# Altium schematic sheet Fabric_E_CON.SchDoc: Metlino
size 420 x 297 mm; CheckedBy: P.Kulik,T.Przywozki,W.Ruclo; Author: G.Kasprowicz; CompanyName: WUT ISE; DrawnBy: G.Kasprowicz; Organization: WUT ISE; Address1: PW ISE; Address2: Nowowiejska 15/19 00-665 Warsaw; Address3: gkasprow@gmail.com; DocumentNumber: 15; Revision: 2; SheetNumber: 15; SheetTotal: 29; ModifiedBy: -; CheckedDate: -; Title2: MCH Tongue 3&4 connectors; DivGrp: WUT ISE; Designer: G.Kasprowicz; ModifiedDate: -; ProjectName: Sensor Box
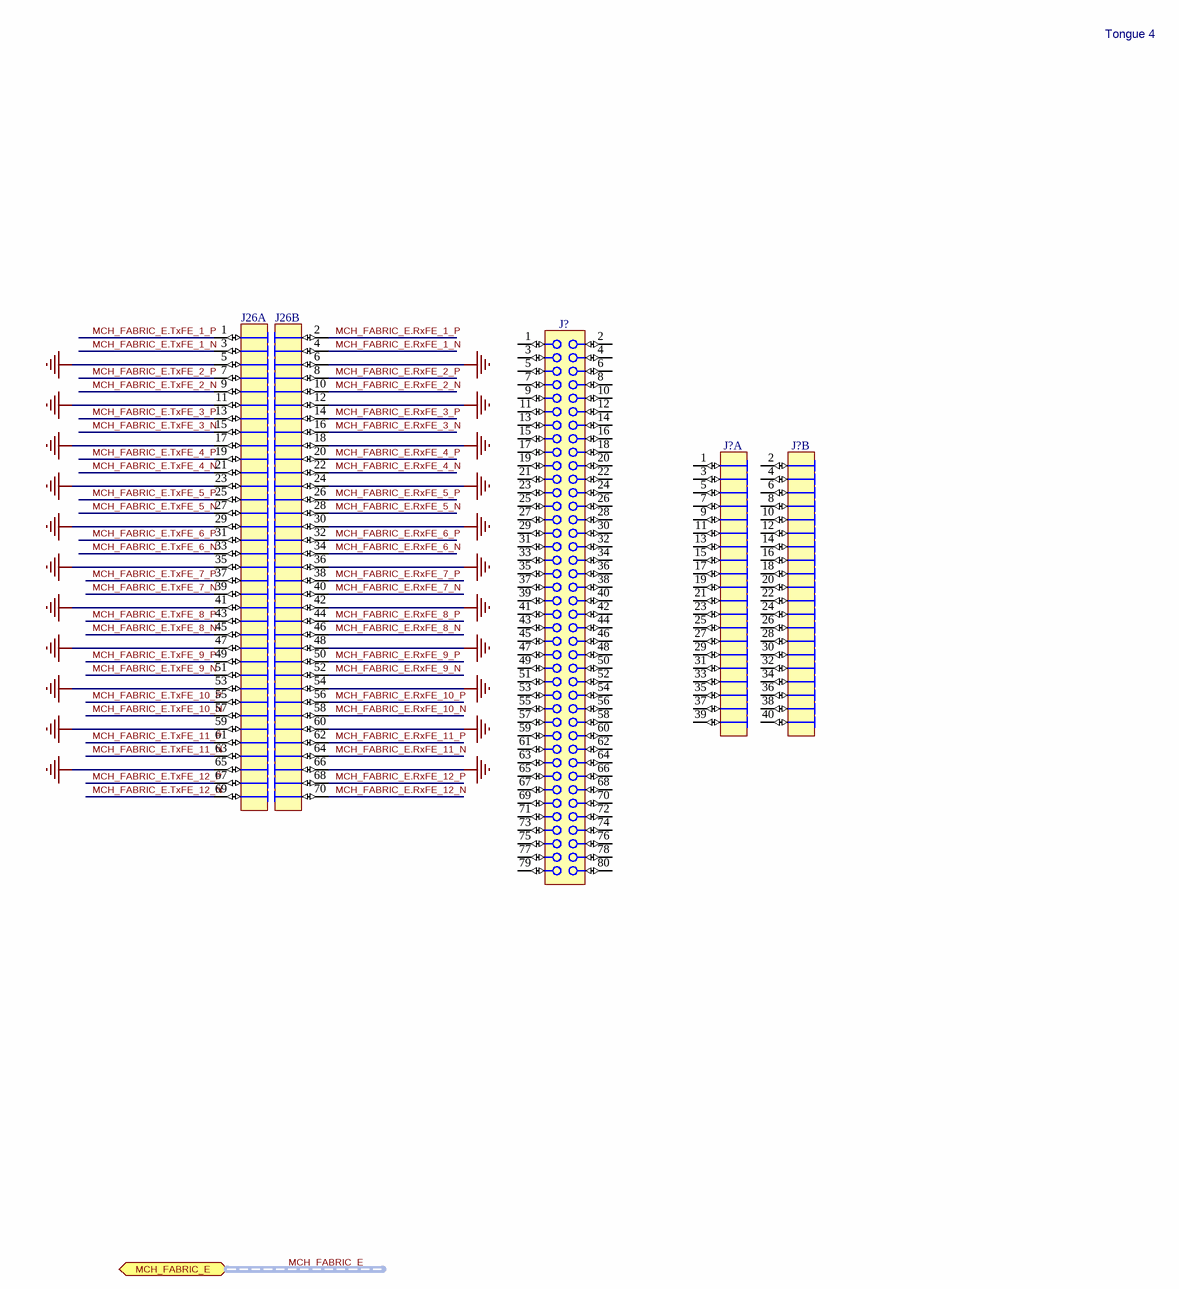
[diagram p0: Fabric_E_CON.SchDoc]

## Parts
(Parts that share a designator on the sheet are numbered #1, #2 ... from top to bottom, then left to right.)
J26  (no value)  [SAMTEC_FSI-135-XX-X-D-AD_bot]  (parts A,B of 2)  (no BOM)
J?#1  Socket 80  [SAMTEC_FSI-140-10-X-D-AD]  (value not drawn)
J?#2  (no value)  [SAMTEC_FSI-120-XX-X-D-AD_bot]  (part A of 2)  (no BOM)
J?#3  (no value)  [SAMTEC_FSI-120-XX-X-D-AD_bot]  (part B of 2)  (no BOM)

## Ports
MCH_FABRIC_E (bidir, harness MCH_FABRIC_E)

## Nets
GND: J26.5 J26.6 J26.11 J26.12 J26.17 J26.18 J26.23 J26.24 J26.29 J26.30 J26.35 J26.36 J26.41 J26.42 J26.47 J26.48 J26.53 J26.54 J26.59 J26.60 J26.65 J26.66
MCH_FABRIC_E.RxFE_1_N: J26.4
MCH_FABRIC_E.RxFE_1_P: J26.2
MCH_FABRIC_E.RxFE_2_N: J26.10
MCH_FABRIC_E.RxFE_2_P: J26.8
MCH_FABRIC_E.RxFE_3_N: J26.16
MCH_FABRIC_E.RxFE_3_P: J26.14
MCH_FABRIC_E.RxFE_4_N: J26.22
MCH_FABRIC_E.RxFE_4_P: J26.20
MCH_FABRIC_E.RxFE_5_N: J26.28
MCH_FABRIC_E.RxFE_5_P: J26.26
MCH_FABRIC_E.RxFE_6_N: J26.34
MCH_FABRIC_E.RxFE_6_P: J26.32
MCH_FABRIC_E.RxFE_7_N: J26.40
MCH_FABRIC_E.RxFE_7_P: J26.38
MCH_FABRIC_E.RxFE_8_N: J26.46
MCH_FABRIC_E.RxFE_8_P: J26.44
MCH_FABRIC_E.RxFE_9_N: J26.52
MCH_FABRIC_E.RxFE_9_P: J26.50
MCH_FABRIC_E.RxFE_10_N: J26.58
MCH_FABRIC_E.RxFE_10_P: J26.56
MCH_FABRIC_E.RxFE_11_N: J26.64
MCH_FABRIC_E.RxFE_11_P: J26.62
MCH_FABRIC_E.RxFE_12_N: J26.70
MCH_FABRIC_E.RxFE_12_P: J26.68
MCH_FABRIC_E.TxFE_1_N: J26.3
MCH_FABRIC_E.TxFE_1_P: J26.1
MCH_FABRIC_E.TxFE_2_N: J26.9
MCH_FABRIC_E.TxFE_2_P: J26.7
MCH_FABRIC_E.TxFE_3_N: J26.15
MCH_FABRIC_E.TxFE_3_P: J26.13
MCH_FABRIC_E.TxFE_4_N: J26.21
MCH_FABRIC_E.TxFE_4_P: J26.19
MCH_FABRIC_E.TxFE_5_N: J26.27
MCH_FABRIC_E.TxFE_5_P: J26.25
MCH_FABRIC_E.TxFE_6_N: J26.33
MCH_FABRIC_E.TxFE_6_P: J26.31
MCH_FABRIC_E.TxFE_7_N: J26.39
MCH_FABRIC_E.TxFE_7_P: J26.37
MCH_FABRIC_E.TxFE_8_N: J26.45
MCH_FABRIC_E.TxFE_8_P: J26.43
MCH_FABRIC_E.TxFE_9_N: J26.51
MCH_FABRIC_E.TxFE_9_P: J26.49
MCH_FABRIC_E.TxFE_10_N: J26.57
MCH_FABRIC_E.TxFE_10_P: J26.55
MCH_FABRIC_E.TxFE_11_N: J26.63
MCH_FABRIC_E.TxFE_11_P: J26.61
MCH_FABRIC_E.TxFE_12_N: J26.69
MCH_FABRIC_E.TxFE_12_P: J26.67

Not connected (* = marked no-connect by the designer): J?#1 1 2 3 4 5 6 7 8 9 10 11 12 13 14 15 16 17 18 19 20 21 22 23 24 25 26 27 28 29 30 31 32 33 34 35 36 37 38 39 40 41 42 43 44 45 46 47 48 49 50 51 52 53 54 55 56 57 58 59 60 61 62 63 64 65 66 67 68 69 70 71 72 73 74 75 76 77 78 79 80; J?#2 1 3 5 7 9 11 13 15 17 19 21 23 25 27 29 31 33 35 37 39; J?#3 2 4 6 8 10 12 14 16 18 20 22 24 26 28 30 32 34 36 38 40

## Buses and harness runs
harness MCH_FABRIC_E = port MCH_FABRIC_E

## Notes on the sheet
- Tongue 4
- Project/Equipment
- Document
- Designer
- Drawn by
- Check.by
- Copyright WUT ISE 2018.
  This documentation describes Open Hardware and is licensed under the CERN OHL v.1.1. You may redistribute and modify this documentation under the terms of the CERN OHL v.1.1. (http://ohwr.org/CERNOHL). This documentation is distributed WITHOUT ANY EXPRESS OR IMPLIED WARRANTY, INCLUDING OF MERCHANTABILITY, SATISFACTORY QUALITY AND FITNESS FOR A PARTICULAR PURPOSE. Please see the CERN OHL v.1.1 for applicable conditions.
- Contact
- File
- Last Mod.
- Print Date
- Sheet
- Size
- A3
- of
- Rev

## Library data of the parts
J26 = SAMTEC_FSI-135-06-L-D-AD_bot: Copper Contact Surfaces for Receive 70 Spring Contacts Board to Board & Mezzanine Connectors One-Piece With Alignment Pins; PressFit: No; Part Number: SAMTEC_FSI-135-06-L-D-AD_bot; Component Type: Standard (No BOM); Pin Count: 70; Mounted: Yes; Socket: No; SMD: No; Sense: No; Status: None; Part Description: Copper Contact Surfaces for Receive 70 Spring Contacts Board to Board & Mezzanine Connectors One-Piece With Alignment Pins; ComponentHeight: 0mm; HelpURL: \\cern.ch\dfs\Applications\Altium\Datasheets\SAMTEC_FSI-135-06-L-D-AD.pdf; Author: CERN DEM BC; CreateDate: 17.12.2019; LatestRevisionDate: 17.12.2019
J?#1 = SAMTEC_FSI-140-10-L-D-AD: Connector 80 Female; Part Description: 80 Contacts, Pitch 1mm, Dual Row Low Profile (10mm) & Elevated One-Piece With Alignment Pins; Manufacturer: SAMTEC; PressFit: No; Part Number: SAMTEC_FSI-140-10-L-D-AD; Component Kind: Standard; Component Type: Standard; Pin Count: 80; Family: Socket 80; Mounted: Yes; Socket: No; SMD: Yes; Sense: No; Status: None; Manufacturer Part Number: FSI-140-10-L-D-AD; ComponentHeight: 10mm; HelpURL: \\cern.ch\dfs\Applications\Altium\Datasheets\SAMTEC_FSI-140-10-L-D-AD.pdf; Author: CERN DEM BC; CreateDate: 08.06.2021; LatestRevisionDate: 08.06.2021
J?#2 J?#3 = SAMTEC_FSI-120-06-L-D-AD_bot: Copper Contact Surfaces for Receive 40 Spring Contacts Board to Board & Mezzanine Connectors One-Piece With Alignment Pins; PressFit: No; Part Number: SAMTEC_FSI-120-06-L-D-AD_bot; Component Type: Standard (No BOM); Pin Count: 0; Mounted: Yes; Socket: No; SMD: No; Sense: No; Status: None; Part Description: Copper Contact Surfaces for Receive 40 Spring Contacts Board to Board & Mezzanine Connectors One-Piece With Alignment Pins; ComponentHeight: 0mm; HelpURL: \\cern.ch\dfs\Applications\Altium\Datasheets\SAMTEC_FSI-120-06-L-D-AD.pdf; Author: CERN DEM BC; CreateDate: 08.06.2021; LatestRevisionDate: 08.06.2021